# EAGLE design WSN_Gateway_feather_v2 (EAGLE 7.5.0)
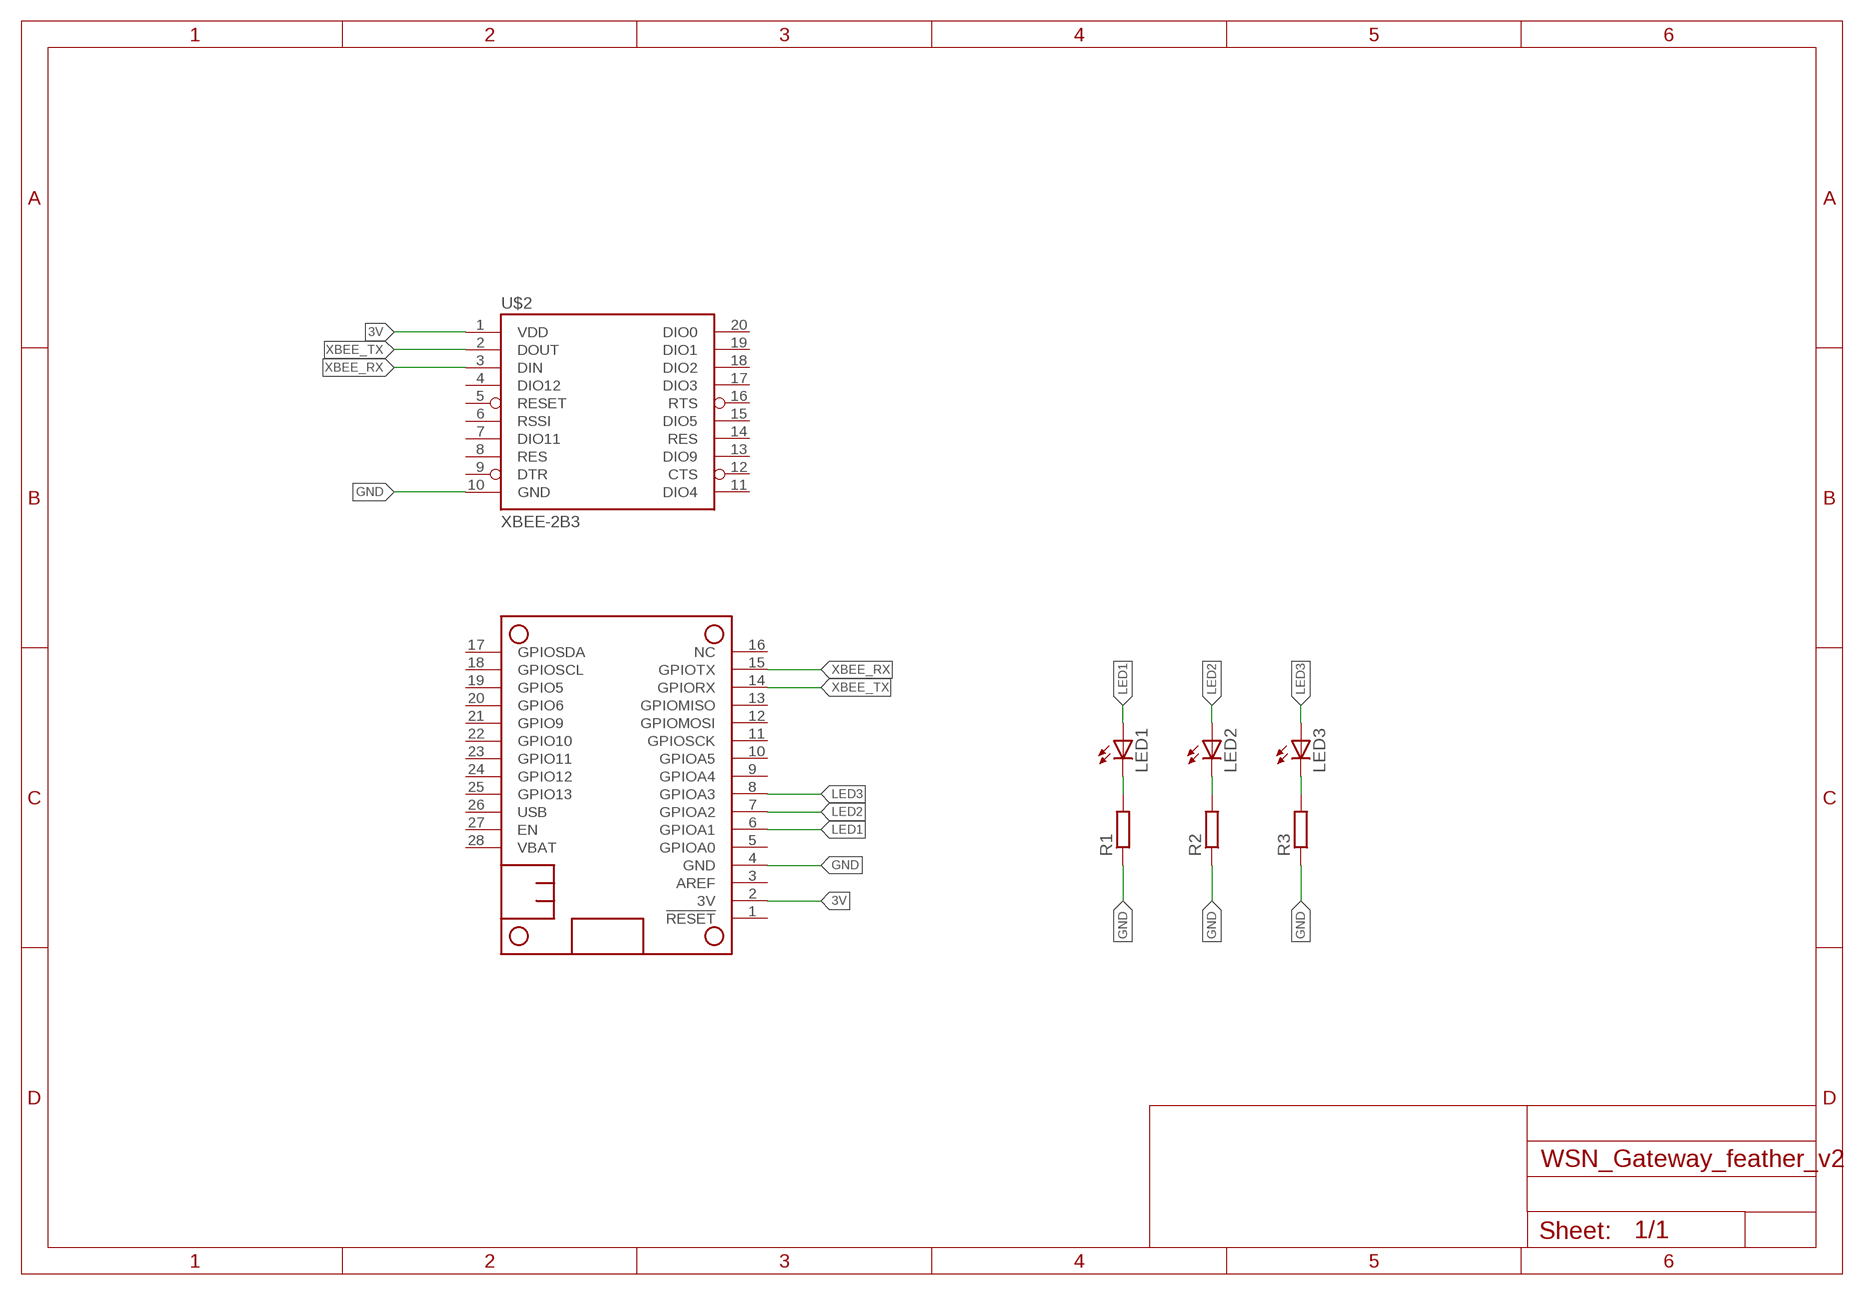
[diagram p0: schematic, sheet 1]

## Parts
LED1  LEDCHIPLED_0805  [CHIPLED_0805]
LED2  LEDCHIPLED_0805  [CHIPLED_0805]
LED3  LEDCHIPLED_0805  [CHIPLED_0805]
MS1  FEATHERWING_NODIM_NOHOLES  [FEATHERWING_DIM_2]
R1  R-EU_R0805  [R0805]
R2  R-EU_R0805  [R0805]
R3  R-EU_R0805  [R0805]
U$2  XBEE-2B3  [XBEE-SMD]

## Nets
3V: MS1.2(3V) U$2.1(VDD)
GND: MS1.4(GND) R1.1 R2.1 R3.1 U$2.10(GND)
LED1: LED1.A MS1.6(GPIOA1)
LED2: LED2.A MS1.7(GPIOA2)
LED3: LED3.A MS1.8(GPIOA3)
N$1: LED1.C R1.2
N$2: LED2.C R2.2
N$3: LED3.C R3.2
XBEE_RX: MS1.15(GPIOTX) U$2.3(DIN)
XBEE_TX: MS1.14(GPIORX) U$2.2(DOUT)
Unconnected: MS1.1(!RESET) MS1.3(AREF) MS1.5(GPIOA0) MS1.9(GPIOA4) MS1.10(GPIOA5) MS1.11(GPIOSCK) MS1.12(GPIOMOSI) MS1.13(GPIOMISO) MS1.16(NC) MS1.17(GPIOSDA) MS1.18(GPIOSCL) MS1.19(GPIO5) MS1.20(GPIO6) MS1.21(GPIO9) MS1.22(GPIO10) MS1.23(GPIO11) MS1.24(GPIO12) MS1.25(GPIO13) MS1.26(USB) MS1.27(EN) MS1.28(VBAT) U$2.4(DIO12) U$2.5(RESET) U$2.6(RSSI) U$2.7(DIO11) U$2.8(RES) U$2.9(DTR) U$2.11(DIO4) U$2.12(CTS) U$2.13(DIO9) U$2.14(RES) U$2.15(DIO5) U$2.16(RTS) U$2.17(DIO3) U$2.18(DIO2) U$2.19(DIO1) U$2.20(DIO0)

## Library data of the parts
LED1-LED3 = adafruit:LED: LED OSRAM: - CHIPLED LG R971, LG N971, LY N971, LG Q971, LY Q971, LO R971, LY R971 LH N974, LH R974 LS Q976, LO Q976, LY Q976 LO Q996 - Hyper CHIPLED LW Q18S LB Q993, LB Q99A, LB R99A - SideLED LS A670, LO A670, LY A670, LG A670, LP A670 LB A673, LV A673, LT A673, LW A673 LH A674 LY A675 LS A676, LA A676, LO A676, LY A676, LW A676 LS A679, LY A679, LG A679 - Hyper Micro SIDELED® LS Y876, LA Y876, LO Y876, LY Y876 LT Y87S - SmartLED LW L88C, LW L88S LB L89C, LB L89S, LG L890 LS L89K, LO L89K, LY L89K LS L896, LA L896, LO L896, LY L896 - TOPLED LS T670, LO T670, LY T670, LG T670, LP T670 LSG T670, LSP T670, LSY T670, LOP T670, LYG T670 LG T671, LOG T671, LSG T671 LB T673, LV T673, LT T673, LW T673 LH T674 LS T676, LA T676, LO T676, LY T676, LB T676, LH T676, LSB T676, LW T676 LB T67C, LV T67C, LT T67C, LS T67K, LO T67K, LY T67K, LW E67C LS E67B, LA E67B, LO E67B, LY E67B, LB E67C, LV E67C, LT E67C LW T67C LS T679, LY T679, LG T679 LS T770, LO T770, LY T770, LG T770, LP T770 LB T773, LV T773, LT T773, LW T773 LH T774 LS E675, LA E675, LY E675, LS T675 LS T776, LA T776, LO T776, LY T776, LB T776 LHGB T686 LT T68C, LB T68C - Hyper Mini TOPLED® LB M676 - Mini TOPLED Santana® LG M470 LS M47K, LO M47K, LY M47K Source: http://www.osram.convergy.de/
MS1 = adafruit:FEATHERWING
R1-R3 = rcl:R-EU_: RESISTOR, European symbol
U$2 = SparkFun-RF:XBEE-2: Xbee module footprints SMT header is CONN-09042.; PROD_ID: CONN-09042

## Board
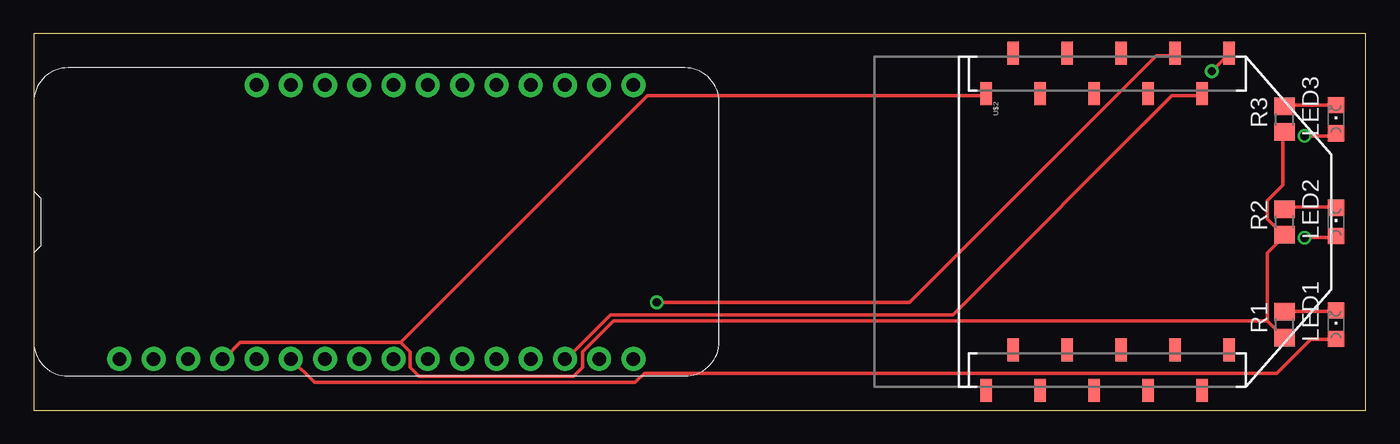
[diagram p1: board, top side]
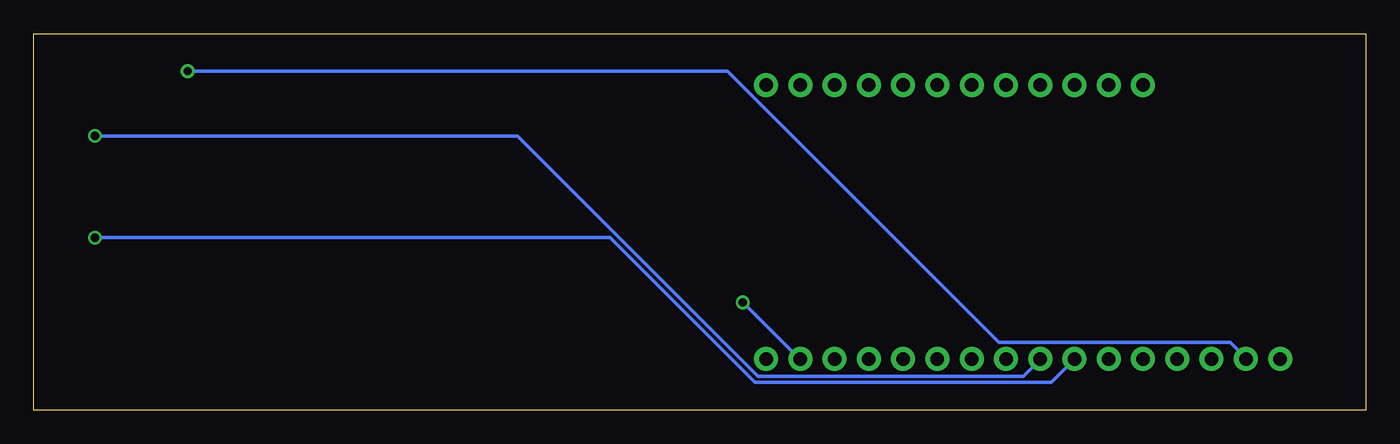
[diagram p2: board, bottom side, seen from below]

Size 98.73 x 27.93 mm. Coordinates in mm from the lower left corner, seen from the top.
Outline: 0,0 98.73,0 98.73,27.93 0,27.93 0,0
Copper layers (1*16): Top 0.035mm / dielectric 1.5mm / Bottom 0.035mm
Design rules "default": minimum track width 10mil, minimum drill 24mil, track to track 8mil, track to pad 8mil, pad to pad 8mil, via to via 8mil, smd to smd 8mil, copper to edge 40mil, drill to drill 8mil, minimum pad ring 10mil, minimum via ring 8mil, stop-mask expansion 4mil, vias tented up to drill 0mil, thermal gap 10mil

### Footprints (pad centres in the part's own frame; a part is rotated, then mirrored left to right if it is on the bottom)
CHIPLED_0805 = smd 1.2 x 1.2: A 0,-1.05; C 0,1.05
FEATHERWING_DIM_2 = drill 1 pad 1.778: 1 6.35,1.27; 2 8.89,1.27; 3 11.43,1.27; 4 13.97,1.27; 5 16.51,1.27; 6 19.05,1.27; 7 21.59,1.27; 8 24.13,1.27; 9 26.67,1.27; 10 29.21,1.27; 11 31.75,1.27; 12 34.29,1.27; 13 36.83,1.27; 14 39.37,1.27; 15 41.91,1.27; 16 44.45,1.27; 17 44.45,21.59; 18 41.91,21.59; 19 39.37,21.59; 20 36.83,21.59; 21 34.29,21.59; 22 31.75,21.59; 23 29.21,21.59; 24 26.67,21.59; 25 24.13,21.59; 26 21.59,21.59; 27 19.05,21.59; 28 16.51,21.59
R0805 = smd 1.3 x 1.5: 1 -0.95,0; 2 0.95,0
XBEE-SMD = smd 1.7 x 0.85: 1 -12.5,20; 2 -9.5,18; 3 -12.5,16; 4 -9.5,14; 5 -12.5,12; 6 -9.5,10; 7 -12.5,8; 8 -9.5,6; 9 -12.5,4; 10 -9.5,2; 11 12.5,2; 12 9.5,4; 13 12.5,6; 14 9.5,8; 15 12.5,10; 16 9.5,12; 17 12.5,14; 18 9.5,16; 19 12.5,18; 20 9.5,20

### Placement (x,y rotation side)
LED1  96.52,6.35 0 top
LED2  96.52,13.97 0 top
LED3  96.52,21.59 0 top
MS1  0,2.54 0 top
R1  92.71,6.35 90 top
R2  92.71,13.97 90 top
R3  92.71,21.59 90 top
U$2  68.58,13.97 270 top

### Tracks (layer width: path | path; a pad name or v marks a point on that pad's centre or on a via)
3V  (via drill 0.61)
  Top 0.254: v87.33,25.15 88.47,26.29 U$2.1
  Bottom 0.254: v87.33,25.15 47.32,25.15 27.2,5.03 10.06,5.03 8.91,3.89 MS1.2
GND
  Top 0.254: 91.44,6.63 92.58,5.49 R1.1 | 91.44,6.63 91.44,11.66 92.58,12.8 R2.1 92.58,13.03 91.44,14.17 91.44,15.54 92.58,16.69 92.58,20.57 R3.1 | 27.2,5.03 45.49,23.32 70.41,23.32 U$2.10 | 27.2,5.03 15.32,5.03 14.17,3.89 MS1.4 | 91.44,6.63 42.98,6.63 40.69,4.34 40.69,3.2 40.01,2.52 28.57,2.52 27.89,3.2 27.89,4.34 27.2,5.03
LED1
  Top 0.254: MS1.6 20.8,2.06 44.58,2.06 45.26,2.74 92.13,2.74 94.64,5.26 96.47,5.26 LED1.A
LED2  (via drill 0.61)
  Top 0.254: v94.18,12.8 96.47,12.8 LED2.A
  Bottom 0.254: v94.18,12.8 56.01,12.8 45.26,2.06 23.32,2.06 21.72,3.66 MS1.7
LED3  (via drill 0.61)
  Top 0.254: v94.18,20.34 96.47,20.34 LED3.A
  Bottom 0.254: v94.18,20.34 62.87,20.34 45.03,2.52 25.38,2.52 24.23,3.66 MS1.8
N$1
  Top 0.254: LED1.C 96.47,7.32 92.81,7.32 R1.2
N$2
  Top 0.254: LED2.C 96.47,15.09 92.81,15.09 R2.2
N$3
  Top 0.254: LED3.C 96.47,22.63 92.81,22.63 R3.2
XBEE_RX  (via drill 0.61)
  Top 0.254: v46.18,8 64.92,8 83.21,26.29 84.35,26.29 U$2.3
  Bottom 0.254: v46.18,8 42.06,3.89 MS1.15
XBEE_TX
  Top 0.254: U$2.2 86.41,23.32 84.35,23.32 68.12,7.09 42.75,7.09 39.55,3.89 MS1.14